# Altium schematic sheet SC941C_STORRB.SchDoc: Sorties TOR Relais Bistable
size 393 x 270 mm; CompanyName: Seccom; Address1: 521, rue du capt. François Garbit; Address2: 69440 Mornant; Address3: seccom@seccom.fr; Address4: www.seccom.fr; DocumentNumber: 8; SheetNumber: 8; SheetTotal: 9; PageSetup: Record=PageOptions|CenterHorizontal=True|CenterVertical=True|PrintScale=0.74|XCorrection=1.00|YCorrection=1.00|PrintKind=0|BorderSize=5000000|LeftOffset=0|BottomOffset=0|Orientation=2|PaperLength=1000|PaperWidth=1000|Scale=100|PaperSource=7|PrintQuality=-4|MediaType=1|DitherType=10|PaperKind=A4|PrintScaleMode=1
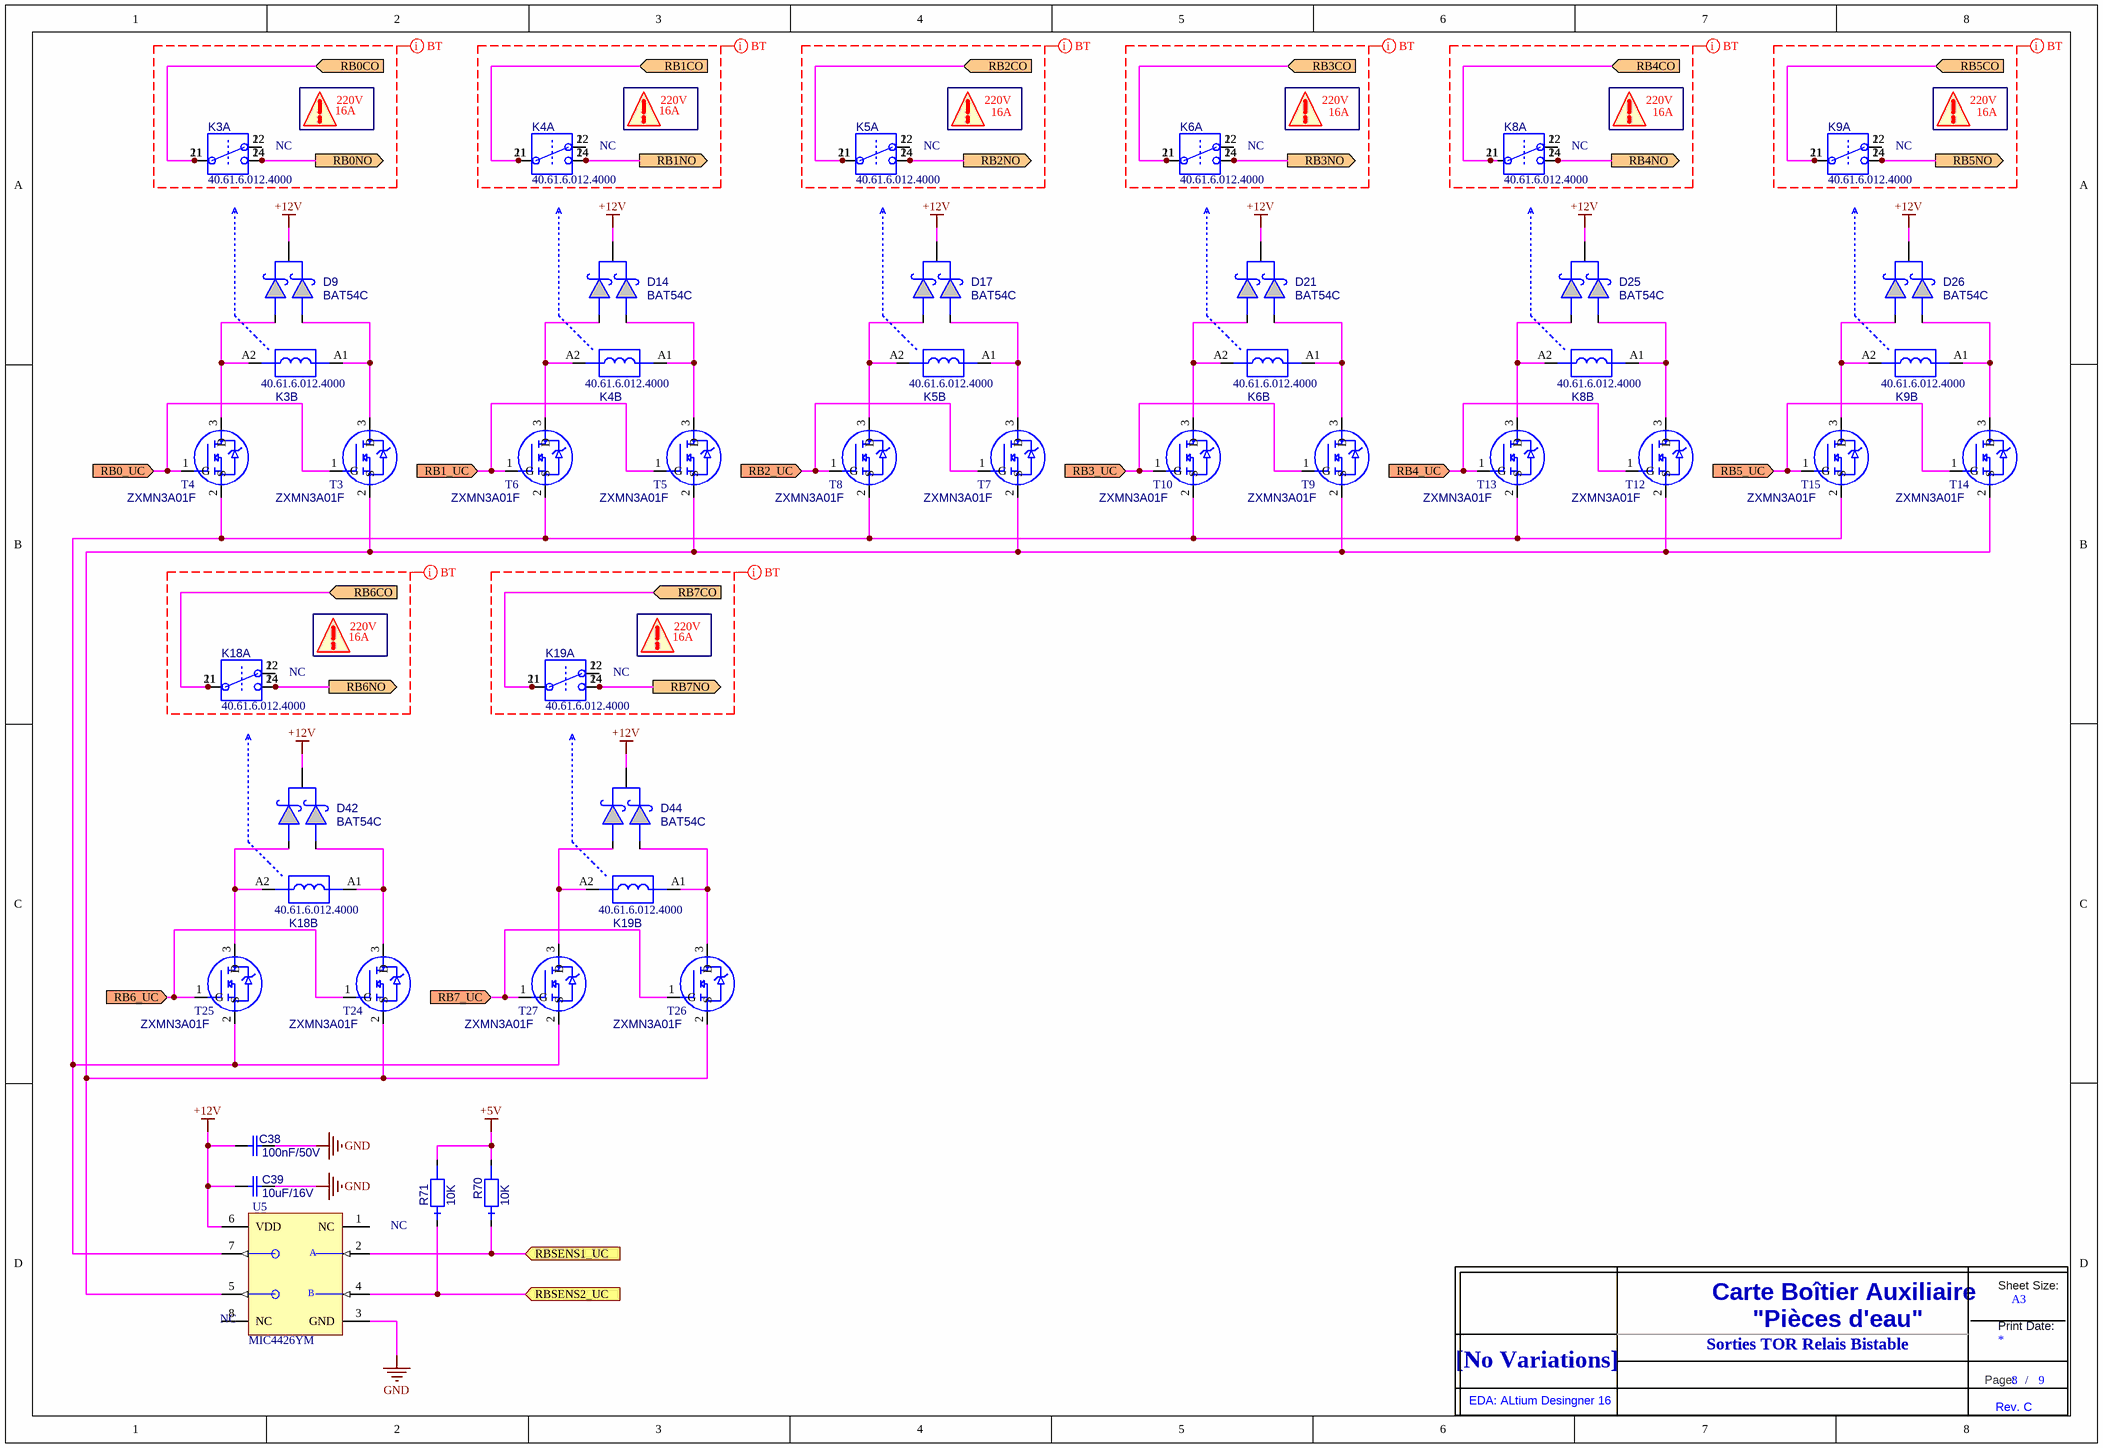
[diagram p0: SC941C_STORRB.SchDoc]

## Parts
C38  value 100nF/50V  [0805_ReflowSoldering_CAP]  (hidden comment: C_0805_X7R_10%_100N-50V)
C39  value 10uF/16V  [0805_ReflowSoldering_CAP]  (hidden comment: C_0805_X5R_10%_10U-16V)
D9  BAT54C  [SOT23_3L_ReflowSoldering]
D14  BAT54C  [SOT23_3L_ReflowSoldering]
D17  BAT54C  [SOT23_3L_ReflowSoldering]
D21  BAT54C  [SOT23_3L_ReflowSoldering]
D25  BAT54C  [SOT23_3L_ReflowSoldering]
D26  BAT54C  [SOT23_3L_ReflowSoldering]
D42  BAT54C  [SOT23_3L_ReflowSoldering]
D44  BAT54C  [SOT23_3L_ReflowSoldering]
K3  value 40.61.6.012.4000  [RELAY_FINDER_40.61_+SUPPORT_95]  (hidden comment: RELAY_12VDC_1RT_BI_40.61.6)  (parts A,B of 2)
K4  value 40.61.6.012.4000  [RELAY_FINDER_40.61_+SUPPORT_95]  (hidden comment: RELAY_12VDC_1RT_BI_40.61.6)  (parts A,B of 2)
K5  value 40.61.6.012.4000  [RELAY_FINDER_40.61_+SUPPORT_95]  (hidden comment: RELAY_12VDC_1RT_BI_40.61.6)  (parts A,B of 2)
K6  value 40.61.6.012.4000  [RELAY_FINDER_40.61_+SUPPORT_95]  (hidden comment: RELAY_12VDC_1RT_BI_40.61.6)  (parts A,B of 2)
K8  value 40.61.6.012.4000  [RELAY_FINDER_40.61_+SUPPORT_95]  (hidden comment: RELAY_12VDC_1RT_BI_40.61.6)  (parts A,B of 2)
K9  value 40.61.6.012.4000  [RELAY_FINDER_40.61_+SUPPORT_95]  (hidden comment: RELAY_12VDC_1RT_BI_40.61.6)  (parts A,B of 2)
K18  value 40.61.6.012.4000  [RELAY_FINDER_40.61_+SUPPORT_95]  (hidden comment: RELAY_12VDC_1RT_BI_40.61.6)  (parts A,B of 2)
K19  value 40.61.6.012.4000  [RELAY_FINDER_40.61_+SUPPORT_95]  (hidden comment: RELAY_12VDC_1RT_BI_40.61.6)  (parts A,B of 2)
R70  value 10K  [0805_ReflowSoldering_RES]  (hidden comment: RES_0805_1%_100PPM_10K)
R71  value 10K  [0805_ReflowSoldering_RES]  (hidden comment: RES_0805_1%_100PPM_10K)
T3  ZXMN3A01F  [SOT23_3L_ReflowSoldering]
T4  ZXMN3A01F  [SOT23_3L_ReflowSoldering]
T5  ZXMN3A01F  [SOT23_3L_ReflowSoldering]
T6  ZXMN3A01F  [SOT23_3L_ReflowSoldering]
T7  ZXMN3A01F  [SOT23_3L_ReflowSoldering]
T8  ZXMN3A01F  [SOT23_3L_ReflowSoldering]
T9  ZXMN3A01F  [SOT23_3L_ReflowSoldering]
T10  ZXMN3A01F  [SOT23_3L_ReflowSoldering]
T12  ZXMN3A01F  [SOT23_3L_ReflowSoldering]
T13  ZXMN3A01F  [SOT23_3L_ReflowSoldering]
T14  ZXMN3A01F  [SOT23_3L_ReflowSoldering]
T15  ZXMN3A01F  [SOT23_3L_ReflowSoldering]
T24  ZXMN3A01F  [SOT23_3L_ReflowSoldering]
T25  ZXMN3A01F  [SOT23_3L_ReflowSoldering]
T26  ZXMN3A01F  [SOT23_3L_ReflowSoldering]
T27  ZXMN3A01F  [SOT23_3L_ReflowSoldering]
Title_new  DNI  (value not drawn)  (graphical)
U5  MIC4426YM  [SOIC_08_E1,27_L150_ReflowSoldering]

## Ports
RB0_UC (in), RB0CO (in), RB0NO (out), RB1_UC (in), RB1CO (in), RB1NO (out), RB2_UC (in), RB2CO (in), RB2NO (out), RB3_UC (in), RB3CO (in), RB3NO (out), RB4_UC (in), RB4CO (in), RB4NO (out), RB5_UC (in), RB5CO (in), RB5NO (out), RB6_UC (in), RB6CO (in), RB6NO (out), RB7_UC (in), RB7CO (in), RB7NO (out), RBSENS1_UC (in), RBSENS2_UC (in)

## Nets
+5V: R70.2 R71.2
+12V: C38.1 C39.2 D9.3 D14.3 D17.3 D21.3 D25.3 D26.3 D42.3 D44.3 U5.6(VDD)
GND: C38.2 C39.1 U5.3(GND)
RB0_UC: T3.1(G) T4.1(G) ; port RB0_UC
RB0CO: K3.11(COM) K3.21(COM) ; port RB0CO
RB0NO: K3.14(NO) K3.24(NO) ; port RB0NO
RB1_UC: T5.1(G) T6.1(G) ; port RB1_UC
RB1CO: K4.11(COM) K4.21(COM) ; port RB1CO
RB1NO: K4.14(NO) K4.24(NO) ; port RB1NO
RB2_UC: T7.1(G) T8.1(G) ; port RB2_UC
RB2CO: K5.11(COM) K5.21(COM) ; port RB2CO
RB2NO: K5.14(NO) K5.24(NO) ; port RB2NO
RB3_UC: T9.1(G) T10.1(G) ; port RB3_UC
RB3CO: K6.11(COM) K6.21(COM) ; port RB3CO
RB3NO: K6.14(NO) K6.24(NO) ; port RB3NO
RB4_UC: T12.1(G) T13.1(G) ; port RB4_UC
RB4CO: K8.11(COM) K8.21(COM) ; port RB4CO
RB4NO: K8.14(NO) K8.24(NO) ; port RB4NO
RB5_UC: T14.1(G) T15.1(G) ; port RB5_UC
RB5CO: K9.11(COM) K9.21(COM) ; port RB5CO
RB5NO: K9.14(NO) K9.24(NO) ; port RB5NO
RB6_UC: T24.1(G) T25.1(G) ; port RB6_UC
RB6CO: K18.11(COM) K18.21(COM) ; port RB6CO
RB6NO: K18.14(NO) K18.24(NO) ; port RB6NO
RB7_UC: T26.1(G) T27.1(G) ; port RB7_UC
RB7CO: K19.11(COM) K19.21(COM) ; port RB7CO
RB7NO: K19.14(NO) K19.24(NO) ; port RB7NO
RBSENS1_UC: R70.1 U5.2(INA) ; port RBSENS1_UC
RBSENS2_UC: R71.1 U5.4(INB) ; port RBSENS2_UC
NetD9_1: D9.1 K3.A1 T3.3(D)
NetD9_2: D9.2 K3.A2 T4.3(D)
NetD14_1: D14.1 K4.A1 T5.3(D)
NetD14_2: D14.2 K4.A2 T6.3(D)
NetD17_1: D17.1 K5.A1 T7.3(D)
NetD17_2: D17.2 K5.A2 T8.3(D)
NetD21_1: D21.1 K6.A1 T9.3(D)
NetD21_2: D21.2 K6.A2 T10.3(D)
NetD25_1: D25.1 K8.A1 T12.3(D)
NetD25_2: D25.2 K8.A2 T13.3(D)
NetD26_1: D26.1 K9.A1 T14.3(D)
NetD26_2: D26.2 K9.A2 T15.3(D)
NetD42_1: D42.1 K18.A1 T24.3(D)
NetD42_2: D42.2 K18.A2 T25.3(D)
NetD44_1: D44.1 K19.A1 T26.3(D)
NetD44_2: D44.2 K19.A2 T27.3(D)
NetK3_12: K3.12(NC) K3.22(NC)
NetK4_12: K4.12(NC) K4.22(NC)
NetK5_12: K5.12(NC) K5.22(NC)
NetK6_12: K6.12(NC) K6.22(NC)
NetK8_12: K8.12(NC) K8.22(NC)
NetK9_12: K9.12(NC) K9.22(NC)
NetK18_12: K18.12(NC) K18.22(NC)
NetK19_12: K19.12(NC) K19.22(NC)
NetT3_2: T3.2(S) T5.2(S) T7.2(S) T9.2(S) T12.2(S) T14.2(S) T24.2(S) T26.2(S) U5.5(~{OUTB})
NetT4_2: T4.2(S) T6.2(S) T8.2(S) T10.2(S) T13.2(S) T15.2(S) T25.2(S) T27.2(S) U5.7(~{OUTA})

Not connected (* = marked no-connect by the designer): U5 1(NC) 8(NC)

## Layout directives
net class BT: (no net found under the mark)

## Notes on the sheet
- 16A
- 220V
- (near K3) NC
- (near K4) NC
- (near K5) NC
- (near K6) NC
- (near K8) NC
- (near K9) NC
- (near K18) NC
- (near K19) NC
- NC
- (near U5) NC
- Sorties TOR Relais Bistable
- (in symbol MIC4426YM) A; B
- (in symbol Title_new) Sheet Size:; Carte Boîtier Auxiliaire; A3; "Pièces d'eau"; Print Date:; [No Variations]; Page:; /; EDA: ALtium Desingner 16; Rev. C

## Library data of the parts
C38 = C_0805_X7R_10%_100N-50V: Condensateur céramique, X7R, 10%, CMS 0805; Creation: LJ; Verification: LJ (28/05/04); Reference: 000042/00; Boitier: 0805; Remarque: {Remarque}; Fabricant: AVX; Ref Fab: 08055C104KAT2A; Coeff: 1; ComponentLink1URL: o:\_Documentation\Datasheets\BC_Components\Condo_CMS_NPO-X7R-Y5V.pdf; ComponentLink2URL: o:\_Documentation\Datasheets\_BOITIERS\PASSIF_CMS\RC_0805_(2x1,25)_(Schneider).PDF; Config: *; ComponentLink1Description: Datasheet; ComponentLink2Description: Datasheet Boitier; Supplier 1: Farnell; Supplier Part Number 1: 499687
C39 = C_0805_X5R_10%_10U-16V: Condensateur céramique, X5R, 10%, CMS 0805; Creation: LJ (12/09/11); Reference: 001715/00; Boitier: 0805; Remarque: {Remarque}; Coeff: 1; Fabricant: Murata; Ref Fab: GRM219R61C106KA73D; Verification: *; ComponentLink1URL: o:\_Documentation\Datasheets\; ComponentLink2URL: o:\_Documentation\Datasheets\_Boitiers\PASSIF_CMS\RC_0805_(2x1,25)_(Schneider).pdf; Config: *; ComponentLink1Description: Datasheet; ComponentLink2Description: Datasheet Boitier
D9 D14 D17 D21 D25 D26 D42 D44 = BAT54C: Diode Schottky double, BAT54 cathode com, Vrrm=30V, If=300mA, Vf=0.4Vmax, CMS; Creation: LJ (14/05/02); Reference: 000597/00; Boitier: SOT23_3L; Remarque: {Remarque}; Fabricant: NXP; Coeff: 1; Verification: LJ (14/05/02); Ref Fab: BAT54C; ComponentLink1URL: o:\_Documentation\Datasheets\NXP\BAT54_series.pdf; ComponentLink2URL: o:\_Documentation\Datasheets\_BOITIERS\ACTIF_CMS\SOT\SOT_23_3P_(Schneider).PDF; Config: *; ComponentLink1Description: Datasheet; ComponentLink2Description: Datasheet Boitier; Value: BAT54C; Supplier 1: Farnell; Supplier Part Number 1: 1081192
K3-K6 K8 K9 K18 K19 = RELAY_12VDC_1RT_BI_40.61.6: Relais 1RT, 12Vdc, série 40.61.6 (bistable), Rc=900R, Sw:250Vac/16A, Ron=? (AgSnO2); Creation: CHD; Verification: LJ (24/11/11); Boitier: type DIP16; Remarque: {Remarque}; Fabricant: Finder; Coeff: 1; Ref Fab: 40.61.6.012.4000; ComponentLink1URL: o:\_Documentation\Datasheets\Finder\Relais_Serie_40.pdf; ComponentLink2URL: o:\_Documentation\Datasheets\_BOITIERS\; Config: *; ComponentLink1Description: Datasheet; ComponentLink2Description: Datasheet Boitier
R70 R71 = RES_0805_1%_100PPM_10K: Résistance CMS 0805, 0.125W, 1%, 100ppm, 150V; Creation: LJ (06/02/09); Reference: 000063/00; Boitier: 0805; Remarque: {Remarque}; Fabricant: Yageo; Ref Fab: RC0805FR-0710KL; Coeff: 1; Verification: *; ComponentLink1URL: o:\_Documentation\Datasheets\BC_Components\Resistances_ThickFilmFlatChip_0402-0603-0805-1206.pdf; ComponentLink2URL: o:\_Documentation\Datasheets\_BOITIERS\PASSIF_CMS\RC_0805_(2x1,25)_(Schneider).PDF; Config: *; ComponentLink1Description: Datasheet; ComponentLink2Description: Datasheet Boitier; Supplier 1: Farnell; Supplier Part Number 1: 9237755
T3-T10 T12-T15 T24-T27 = ZXMN3A01F: Transistor MOSN logique, Vdss=30V, Id=2A, Rdson=0.12R, CMS; Boitier: SOT23_3L; Remarque: {Remarque}; Creation: CHD; Fabricant: Zetex; Coeff: 1; Ref Fab: ZXMN3A01F; ComponentLink1URL: o:\_Documentation\Datasheets\; ComponentLink2URL: o:\_Documentation\Datasheets\_BOITIERS\ACTIF_CMS\SOT\SOT_23_3P_(Schneider).PDF; Config: *; ComponentLink1Description: Datasheet; Value: ZXMN3A01F; Supplier 1: Farnell; Supplier 2: Mouser; Supplier Part Number 1: 9525734; Supplier Part Number 2: 522-ZXMN3A01FTA
Title_new = Title_new
U5 = MIC4426YM: Dual High-Speed 1.5A MOSFET Driver, CMS; Creation: CHD; Verification: LJ (); Boitier: SO8_L150; Remarque: {Remarque}; Fabricant: Micrel; Coeff: 1; Ref Fab: MIC4426YM; ComponentLink1URL: o:\_Documentation\Datasheets\; ComponentLink2URL: o:\_Documentation\Datasheets\_Boitiers\ACTIF_CMS\SOIC\SOIC_08_e1,27_L150_(Schneider).PDF; Config: *; ComponentLink1Description: Datasheet; ComponentLink2Description: Datasheet Boitier; Value: MIC4426YM